# Altium schematic sheet Parking_System.SchDoc
size A
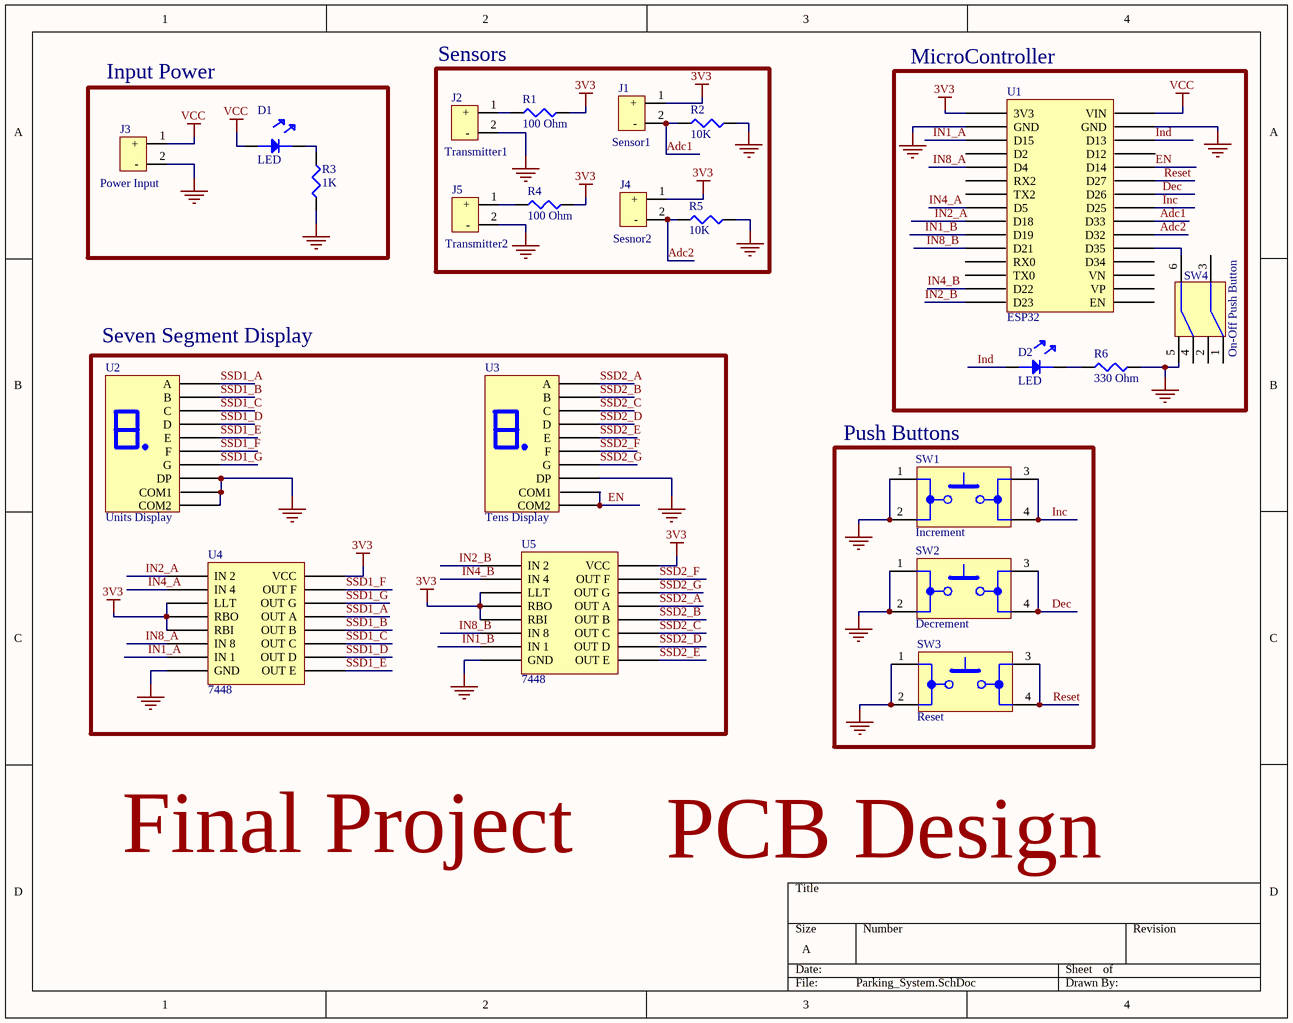
[diagram p0: Parking_System.SchDoc]

## Parts
D1  LED  [LED-05 R]
D2  LED  [LED-05 R]
J1  Sensor1  [CON]
J2  Transmitter1  [CON]
J3  Power Input  [CON]
J4  Sesnor2  [CON]
J5  Transmitter2  [CON]
R1  100 Ohm  [Resistor]
R2  10K  [Resistor]
R3  1K  [Resistor]
R4  100 Ohm  [Resistor]
R5  10K  [Resistor]
R6  330 Ohm  [Resistor]
SW1  Increment  [DIP4 SW]
SW2  Decrement  [DIP4 SW]
SW3  Reset  [DIP4 SW]
SW4  On-Off Push Button  [DIP6 - SW]
U1  ESP32  [ESP32]
U2  Units Display  [SSD]
U3  Tens Display  [SSD]
U4  7448  [DIP16]
U5  7448  [DIP16]

## Blocks framed on the sheet
Sensors: J1 J2 J4 J5 R1 R2 R4 R5
MicroController: D2 R6 SW4 U1
Input Power: D1 J3 R3
Seven Segment Display: U2-U5
Push Buttons: SW1-SW3

## Nets
3V3: J1.1(+) J4.1(+) R1.2 R4.2 U1.1(3V3) U4.3(LLT) U4.4(RBO) U4.5(RBI) U4.16(VCC) U5.3(LLT) U5.4(RBO) U5.5(RBI) U5.16(VCC)
GND: J2.2(-) J3.2(-) J5.2(-) R2.2 R3.1 R5.2 R6.2 SW1.1 SW1.2 SW2.1 SW2.2 SW3.1 SW3.2 SW4.5 U1.2(GND) U1.29(GND) U2.3(COM1) U2.5(DP) U2.8(COM2) U3.5(DP) U4.8(GND) U5.8(GND)
VCC: D1.2(Anode) J3.1(+) U1.30(VIN)
Adc1: J1.2(-) R2.1 U1.22(D33)
Adc2: J4.2(-) R5.1 U1.21(D32)
Dec: SW2.3 SW2.4 U1.24(D26)
EN: U1.26(D14) U3.3(COM1) U3.8(COM2)
IN1_A: U1.3(D15) U4.7(IN_1)
IN1_B: U1.10(D19) U5.7(IN_1)
IN2_A: U1.9(D18) U4.1(IN_2)
IN2_B: U1.15(D23) U5.1(IN_2)
IN4_A: U1.8(D5) U4.2(IN_4)
IN4_B: U1.14(D22) U5.2(IN_4)
IN8_A: U1.5(D4) U4.6(IN_8)
IN8_B: U1.11(D21) U5.6(IN_8)
Inc: SW1.3 SW1.4 U1.23(D25)
Ind: D2.2(Anode) U1.28(D13)
Reset: SW3.3 SW3.4 U1.25(D27)
SSD1_A: U2.7(A) U4.13(OUT_A)
SSD1_B: U2.6(B) U4.12(OUT_B)
SSD1_C: U2.4(C) U4.11(OUT_C)
SSD1_D: U2.2(D) U4.10(OUT_D)
SSD1_E: U2.1(E) U4.9(OUT_E)
SSD1_F: U2.9(F) U4.15(OUT_F)
SSD1_G: U2.10(G) U4.14(OUT_G)
SSD2_A: U3.7(A) U5.13(OUT_A)
SSD2_B: U3.6(B) U5.12(OUT_B)
SSD2_C: U3.4(C) U5.11(OUT_C)
SSD2_D: U3.2(D) U5.10(OUT_D)
SSD2_E: U3.1(E) U5.9(OUT_E)
SSD2_F: U3.9(F) U5.15(OUT_F)
SSD2_G: U3.10(G) U5.14(OUT_G)
NetD1_1: D1.1(Cathode) R3.2
NetD2_1: D2.1(Cathode) R6.1
NetJ2_1: J2.1(+) R1.1
NetJ5_1: J5.1(+) R4.1
NetSW4_6: SW4.6 U1.20(D35)

Not connected (* = marked no-connect by the designer): SW4 1 2 3 4; U1 4(D2) 6(RX2) 7(TX2) 12(RX0) 13(TX0) 16(EN) 17(VP) 18(VN) 19(D34) 27(D12)

## Notes on the sheet
- Final Project
- PCB Design

## Library data of the parts
J1-J5 = 1935161: Conn Terminal Blocks 2 POS 5mm Solder ST Thru-Hole 16A; Manufacturer 1: Phoenix Contact; Max Supply Voltage: 250V; Current Rating: 17.5A; Number of Poles: 2; Number of Levels: 1; Current: 18A; Voltage: 300V; Voltage Rating (DC): 320V; Connector Type: Screw; Wire Gauge (Max): 26AWG; Wire Gauge (Min): 12AWG; Approvals: UL; Supplier 1: Digi-Key; Manufacturer Part Number 1: 1935161; Stock 1: 59845; Pricing 1: 1=0.43000, 10=0.41100, 50=0.39280, 100=0.38200, 250=0.35700, 500=0.32844, 1000=0.30350 (USD); RoHS: Yes; Mount: Through Hole; Number of Pins: 2; Weight: 0.067021oz; Color: Green; Material: Nylon; Housing Color: Green; Housing Material: Polyamide; Insulation Material: Nylon; Contact Material: Copper,Tin; Number of Rows: 1; Max Current Rating: 16A; Voltage Rating: 250V; Package Quantity: 250; Packaging: Bulk; Number of Positions: 2; Number of Positions Per Level: 2; Termination: Solder; Number of Contacts: 2; Number of Circuits: 2; Orientation: Straight; Length: 9mm; Height: 11.3mm; Width: 14.9mm; Pitch: 5mm; Depth: 9mm; Wire/Cable Gauge: 26AWG; Radiation Hardening: No; Lead Free: Lead Free; Flammability Rating: UL94 V-0; REACH SVHC: Unknown; ComponentLink1URL: https://datasheet.ciiva.com/15169/getdatasheetpartid-177903-15169663.pdf?src-supplier=Verical; ComponentLink1Description: https://datasheet.ciiva.com/15169/getdatasheetpartid-177903-15169663.pdf?src-supplier=Verical; ComponentLink2URL: https://datasheet.ciiva.com/16047/1935161-16047247.pdf?src-supplier=Onlinecomponents.com; ComponentLink2Description: https://datasheet.ciiva.com/16047/1935161-16047247.pdf?src-supplier=Onlinecomponents.com; ComponentLink3URL: https://datasheet.ciiva.com/824/combiconcompact5-0mmseries-824222.pdf?src-supplier=Digi-Key; ComponentLink3Description: https://datasheet.ciiva.com/824/combiconcompact5-0mmseries-824222.pdf?src-supplier=Digi-Key; Supplier Part Number 1: 277-1667-ND
R1-R6 = Resistor
SW1-SW3 = Push Button
U2 U3 = SSD: Seven Segment Display / Coomin Cathode
U4 U5 = 7448: BCD to 7 segment decoder / Common Cathode